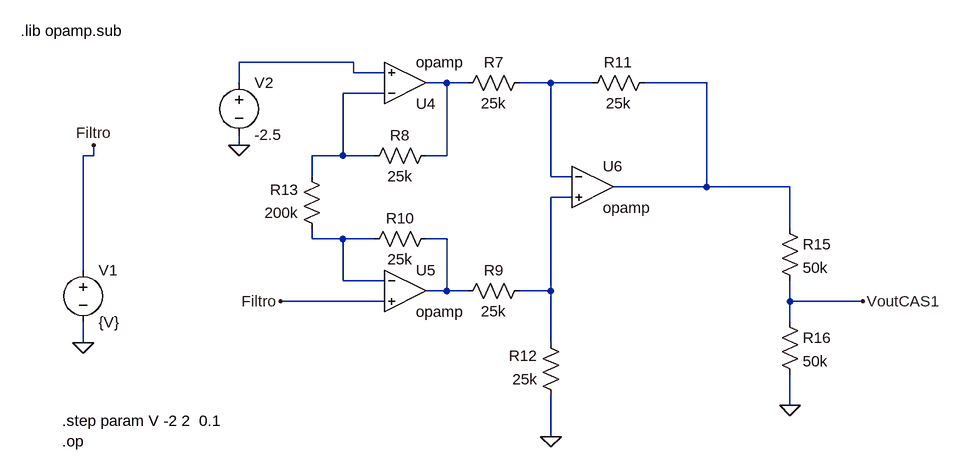
[diagram p0: schematic Draft1.asc]
Draft1.asc, the LTspice schematic file:
Version 4
SHEET 1 980 804
WIRE 48 -496 -128 -496
WIRE 48 -480 48 -496
WIRE 96 -480 48 -480
WIRE -128 -464 -128 -496
WIRE 192 -464 160 -464
WIRE 224 -464 192 -464
WIRE 352 -464 304 -464
WIRE 416 -464 352 -464
WIRE 592 -464 496 -464
WIRE 96 -448 32 -448
WIRE -128 -368 -128 -384
WIRE -352 -352 -352 -368
WIRE -352 -352 -368 -352
WIRE 32 -352 32 -448
WIRE 32 -352 -16 -352
WIRE 80 -352 32 -352
WIRE 192 -352 192 -464
WIRE 192 -352 160 -352
WIRE -16 -320 -16 -352
WIRE 352 -320 352 -464
WIRE 384 -320 352 -320
WIRE 592 -304 592 -464
WIRE 592 -304 448 -304
WIRE 720 -304 592 -304
WIRE 384 -288 352 -288
WIRE 720 -240 720 -304
WIRE -16 -224 -16 -240
WIRE 32 -224 -16 -224
WIRE 80 -224 32 -224
WIRE 192 -224 160 -224
WIRE -368 -176 -368 -352
WIRE 32 -160 32 -224
WIRE 96 -160 32 -160
WIRE 192 -144 192 -224
WIRE 192 -144 160 -144
WIRE 224 -144 192 -144
WIRE 352 -144 352 -288
WIRE 352 -144 304 -144
WIRE 96 -128 -64 -128
WIRE 720 -128 720 -160
WIRE 832 -128 720 -128
WIRE 720 -96 720 -128
WIRE -368 -64 -368 -96
WIRE 352 -64 352 -144
WIRE 720 32 720 -16
WIRE 352 80 352 16
FLAG 352 80 0
FLAG -64 -128 Filtro
FLAG 720 32 0
FLAG 832 -128 VoutCAS1
FLAG -368 -64 0
FLAG -352 -368 Filtro
FLAG -128 -368 0
SYMBOL Opamps\\opamp 128 -400 M180
SYMATTR InstName U4
SYMBOL res 208 -448 R270
WINDOW 0 32 56 VTop 2
WINDOW 3 0 56 VBottom 2
SYMATTR InstName R7
SYMATTR Value 25k
SYMBOL res 64 -336 R270
WINDOW 0 32 56 VTop 2
WINDOW 3 0 56 VBottom 2
SYMATTR InstName R8
SYMATTR Value 25k
SYMBOL Opamps\\opamp 128 -208 R0
SYMATTR InstName U5
SYMBOL res 208 -128 R270
WINDOW 0 32 56 VTop 2
WINDOW 3 0 56 VBottom 2
SYMATTR InstName R9
SYMATTR Value 25k
SYMBOL res 64 -208 R270
WINDOW 0 32 56 VTop 2
WINDOW 3 0 56 VBottom 2
SYMATTR InstName R10
SYMATTR Value 25k
SYMBOL Opamps\\opamp 416 -368 R0
SYMATTR InstName U6
SYMBOL res 512 -480 R90
WINDOW 0 0 56 VBottom 2
WINDOW 3 32 56 VTop 2
SYMATTR InstName R11
SYMATTR Value 25k
SYMBOL res 368 32 R180
WINDOW 0 36 76 Left 2
WINDOW 3 36 40 Left 2
SYMATTR InstName R12
SYMATTR Value 25k
SYMBOL res 0 -224 R180
WINDOW 0 36 76 Left 2
WINDOW 3 36 40 Left 2
SYMATTR InstName R13
SYMATTR Value 200k
SYMBOL res 704 -256 R0
SYMATTR InstName R15
SYMATTR Value 50k
SYMBOL res 704 -112 R0
SYMATTR InstName R16
SYMATTR Value 50k
SYMBOL voltage -368 -192 R0
SYMATTR InstName V1
SYMATTR Value {V}
SYMBOL voltage -128 -480 R0
WINDOW 123 0 0 Left 2
WINDOW 39 0 0 Left 2
SYMATTR InstName V2
SYMATTR Value -2.5
TEXT -400 56 Left 2 !.step param V -2 2  0.1\n.op
TEXT -464 -544 Left 2 !.lib opamp.sub

The netlist it stands for:
* Draft1.asc
XU4 N005 N001 N002 opamp Aol=100K GBW=10Meg  ; pins invin noninvin out
R7 N002 N003 25k
R8 N005 N002 25k
XU5 N007 Filtro N008 opamp Aol=100K GBW=10Meg  ; pins invin noninvin out
R9 N008 N006 25k
R10 N007 N008 25k
XU6 N003 N006 N004 opamp Aol=100K GBW=10Meg  ; pins invin noninvin out
R11 N004 N003 25k
R12 0 N006 25k
R13 N007 N005 200k
R15 N004 VoutCAS1 50k
R16 VoutCAS1 0 50k
V1 Filtro 0 {V}
V2 N001 0 -2.5
.step param V -2 2  0.1
.op
.lib opamp.sub
.backanno
.end